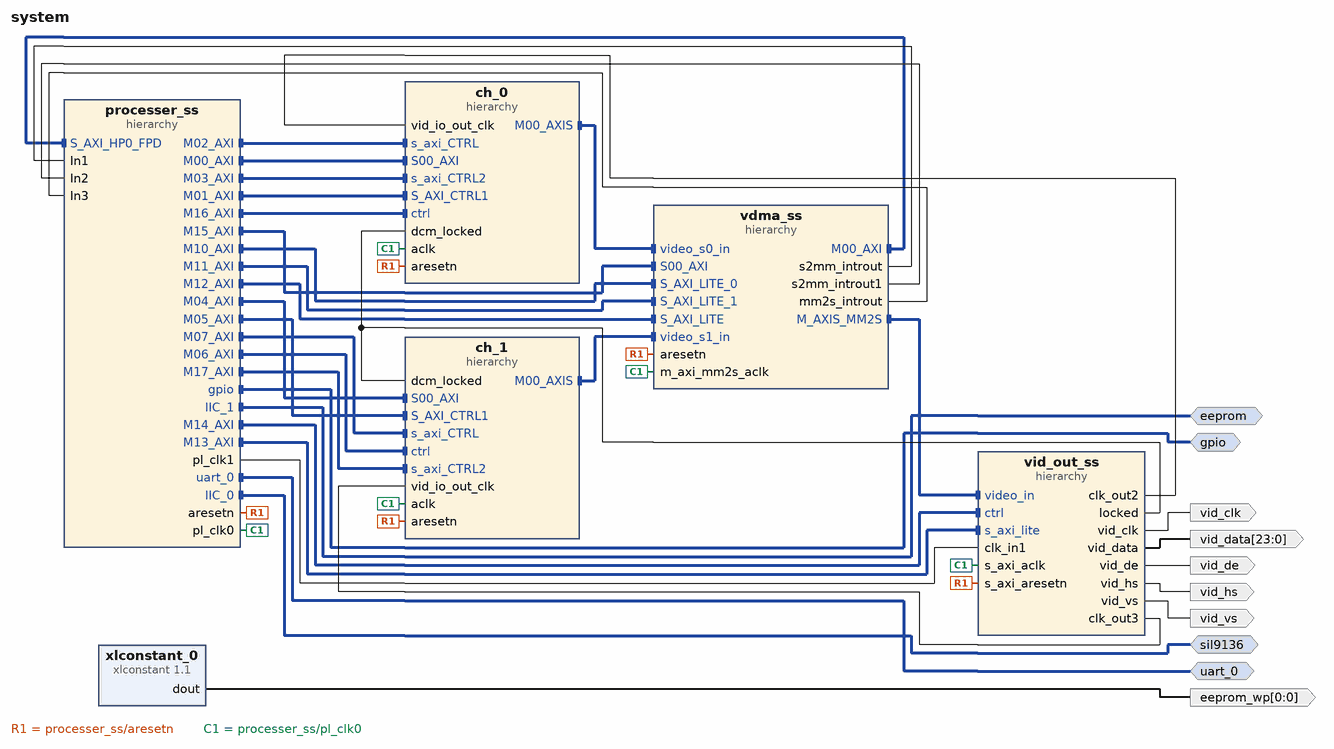
[diagram p0: block diagram of the top level]
# Vivado block design system, xczu2cg-sfvc784-1-e, Vivado 2020.1
create_bd_design system

create_bd_intf_port -mode Master -vlnv xilinx.com:interface:gpio_rtl:1.0 gpio
create_bd_intf_port -mode Master -vlnv xilinx.com:interface:uart_rtl:1.0 uart_0
create_bd_intf_port -mode Master -vlnv xilinx.com:interface:iic_rtl:1.0 sil9136
create_bd_intf_port -mode Master -vlnv xilinx.com:interface:iic_rtl:1.0 eeprom
create_bd_port -dir O vid_clk
create_bd_port -dir O -from 23 -to 0 vid_data
create_bd_port -dir O vid_de
create_bd_port -dir O vid_hs
create_bd_port -dir O vid_vs
create_bd_port -dir O -from 0 -to 0 -type data eeprom_wp

create_bd_cell -type hier ch_0
create_bd_cell -type hier processer_ss
create_bd_cell -type hier vdma_ss
create_bd_cell -type hier vid_out_ss
create_bd_cell -type ip -vlnv xilinx.com:ip:xlconstant:1.1 xlconstant_0
set_property -dict {CONFIG.CONST_VAL 0} [get_bd_cells xlconstant_0]
create_bd_cell -type hier ch_1

# ---- hierarchy /ch_0 ----
current_bd_instance /ch_0
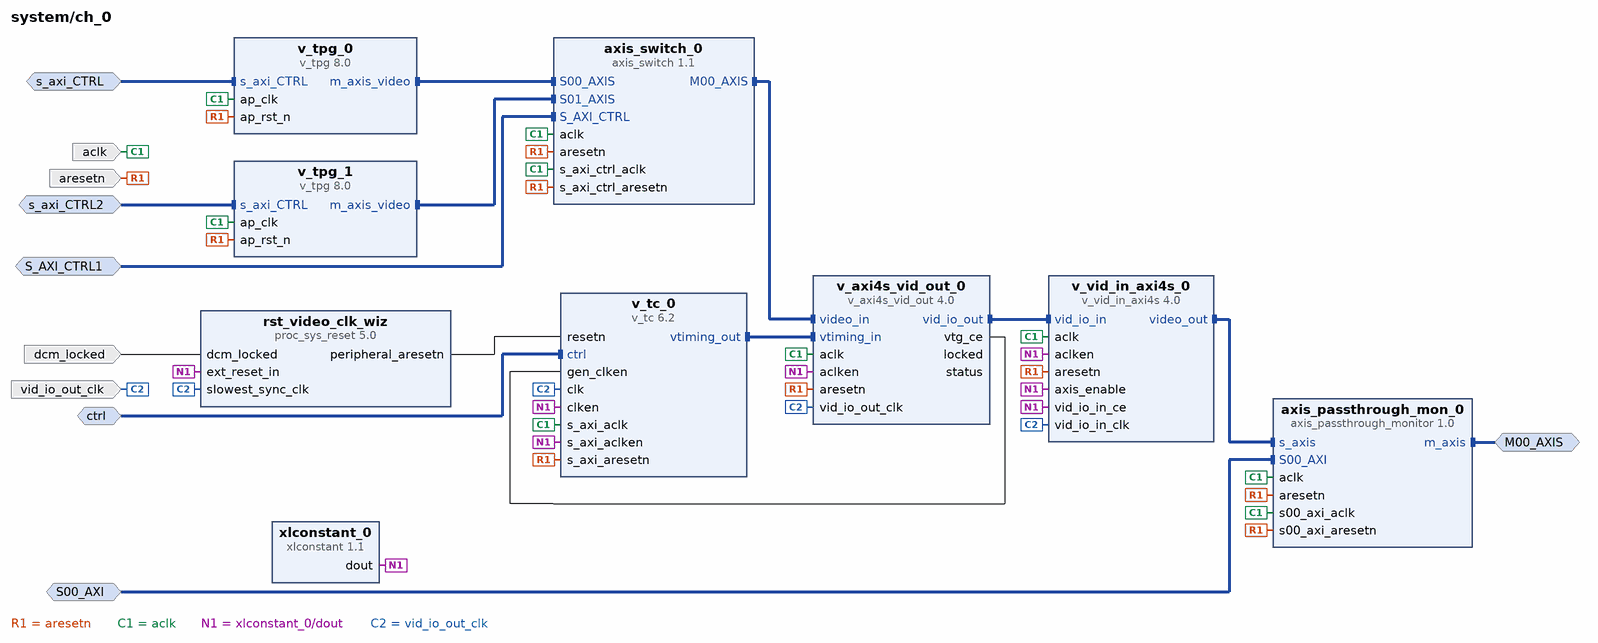
[diagram p1: block diagram inside /ch_0]
create_bd_intf_pin -mode Master -vlnv xilinx.com:interface:axis_rtl:1.0 M00_AXIS
create_bd_intf_pin -mode Slave -vlnv xilinx.com:interface:aximm_rtl:1.0 S00_AXI
create_bd_intf_pin -mode Slave -vlnv xilinx.com:interface:aximm_rtl:1.0 s_axi_CTRL
create_bd_intf_pin -mode Slave -vlnv xilinx.com:interface:aximm_rtl:1.0 S_AXI_CTRL1
create_bd_intf_pin -mode Slave -vlnv xilinx.com:interface:aximm_rtl:1.0 s_axi_CTRL2
create_bd_intf_pin -mode Slave -vlnv xilinx.com:interface:aximm_rtl:1.0 ctrl
create_bd_pin -dir I -type clk aclk
create_bd_pin -dir I -type rst aresetn
create_bd_pin -dir I -type clk vid_io_out_clk
create_bd_pin -dir I dcm_locked

create_bd_cell -type ip -vlnv xilinx.com:user:axis_passthrough_monitor:1.0 axis_passthrough_mon_0
create_bd_cell -type ip -vlnv xilinx.com:ip:v_tpg:8.0 v_tpg_0
set_property -dict {CONFIG.HAS_AXI4_YUV422_YUV420 1 CONFIG.MAX_COLS 3840 CONFIG.MAX_ROWS 2160} [get_bd_cells v_tpg_0]
create_bd_cell -type ip -vlnv xilinx.com:ip:axis_switch:1.1 axis_switch_0
set_property -dict {CONFIG.ROUTING_MODE 1} [get_bd_cells axis_switch_0]
create_bd_cell -type ip -vlnv xilinx.com:ip:v_tpg:8.0 v_tpg_1
set_property -dict {CONFIG.HAS_AXI4_YUV422_YUV420 1 CONFIG.MAX_COLS 3840 CONFIG.MAX_ROWS 2160} [get_bd_cells v_tpg_1]
create_bd_cell -type ip -vlnv xilinx.com:ip:proc_sys_reset:5.0 rst_video_clk_wiz
create_bd_cell -type ip -vlnv xilinx.com:ip:v_axi4s_vid_out:4.0 v_axi4s_vid_out_0
set_property -dict {CONFIG.C_HAS_ASYNC_CLK 1} [get_bd_cells v_axi4s_vid_out_0]
create_bd_cell -type ip -vlnv xilinx.com:ip:v_tc:6.2 v_tc_0
set_property -dict {CONFIG.enable_detection false CONFIG.max_clocks_per_line 8192} [get_bd_cells v_tc_0]
create_bd_cell -type ip -vlnv xilinx.com:ip:xlconstant:1.1 xlconstant_0
create_bd_cell -type ip -vlnv xilinx.com:ip:v_vid_in_axi4s:4.0 v_vid_in_axi4s_0
set_property -dict {CONFIG.C_HAS_ASYNC_CLK 1} [get_bd_cells v_vid_in_axi4s_0]

# ---- hierarchy /processer_ss ----
current_bd_instance /processer_ss
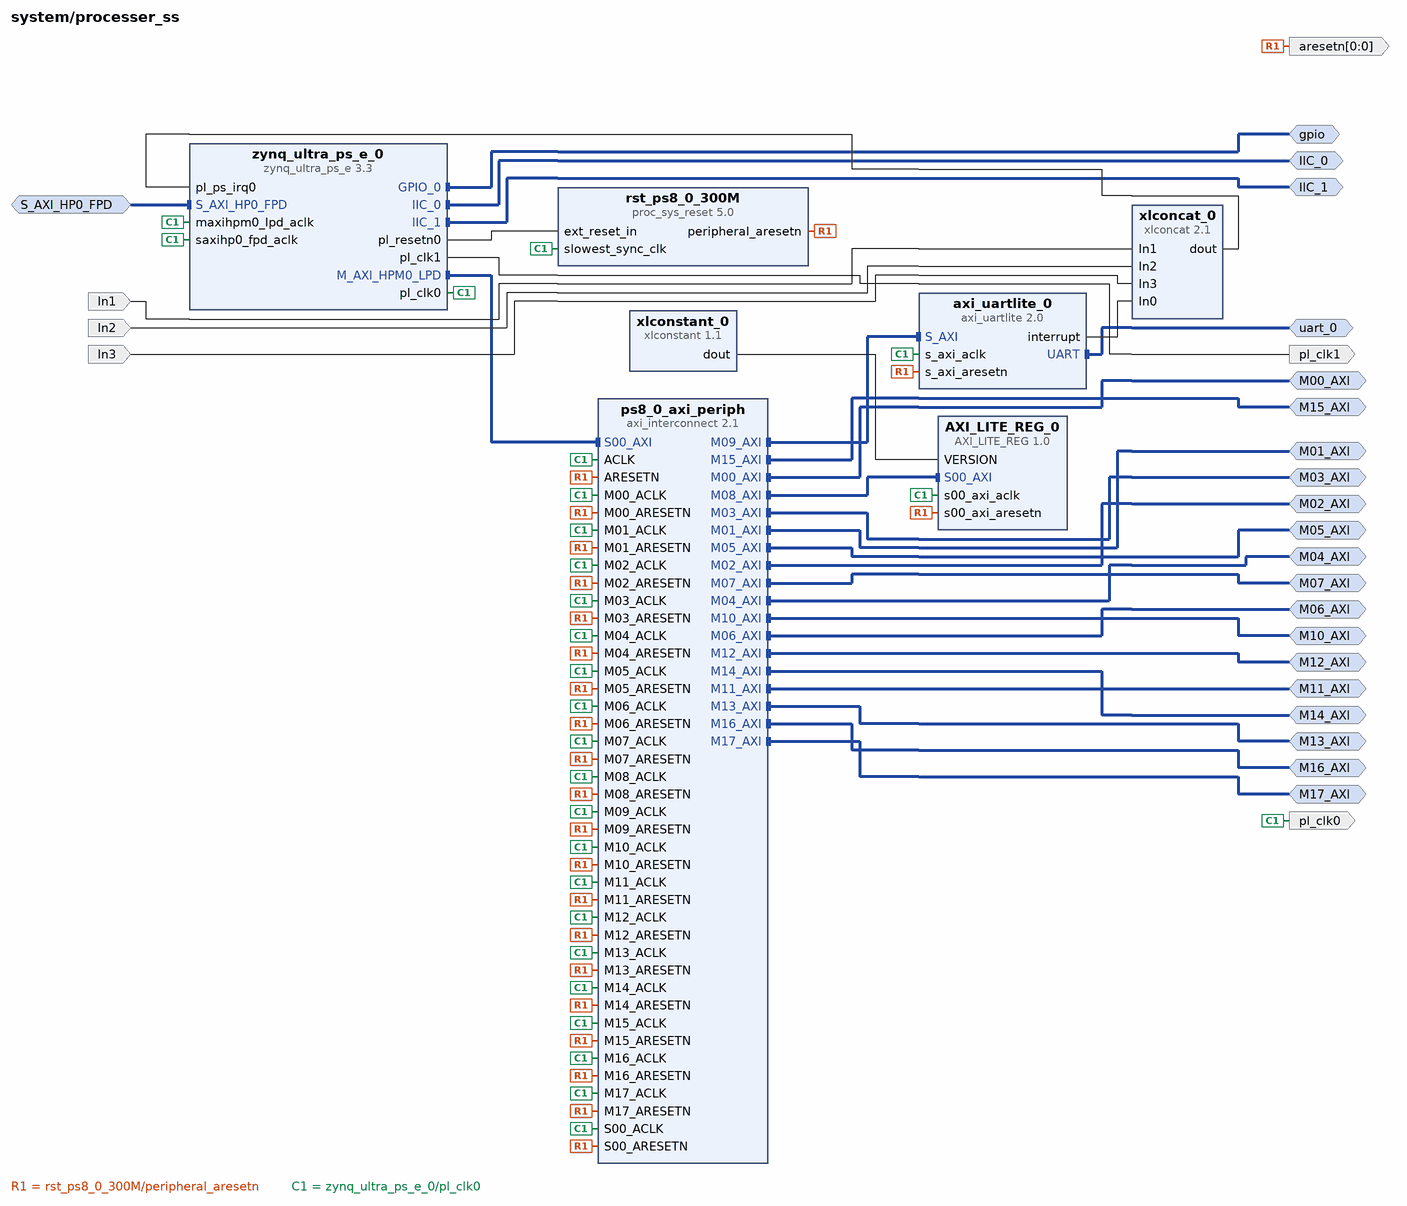
[diagram p2: block diagram inside /processer_ss]
create_bd_intf_pin -mode Slave -vlnv xilinx.com:interface:aximm_rtl:1.0 S_AXI_HP0_FPD
create_bd_intf_pin -mode Master -vlnv xilinx.com:interface:gpio_rtl:1.0 gpio
create_bd_intf_pin -mode Master -vlnv xilinx.com:interface:uart_rtl:1.0 uart_0
create_bd_intf_pin -mode Master -vlnv xilinx.com:interface:aximm_rtl:1.0 M00_AXI
create_bd_intf_pin -mode Master -vlnv xilinx.com:interface:aximm_rtl:1.0 M01_AXI
create_bd_intf_pin -mode Master -vlnv xilinx.com:interface:aximm_rtl:1.0 M02_AXI
create_bd_intf_pin -mode Master -vlnv xilinx.com:interface:aximm_rtl:1.0 M03_AXI
create_bd_intf_pin -mode Master -vlnv xilinx.com:interface:aximm_rtl:1.0 M04_AXI
create_bd_intf_pin -mode Master -vlnv xilinx.com:interface:aximm_rtl:1.0 M05_AXI
create_bd_intf_pin -mode Master -vlnv xilinx.com:interface:aximm_rtl:1.0 M06_AXI
create_bd_intf_pin -mode Master -vlnv xilinx.com:interface:aximm_rtl:1.0 M07_AXI
create_bd_intf_pin -mode Master -vlnv xilinx.com:interface:aximm_rtl:1.0 M10_AXI
create_bd_intf_pin -mode Master -vlnv xilinx.com:interface:aximm_rtl:1.0 M11_AXI
create_bd_intf_pin -mode Master -vlnv xilinx.com:interface:aximm_rtl:1.0 M12_AXI
create_bd_intf_pin -mode Master -vlnv xilinx.com:interface:aximm_rtl:1.0 M13_AXI
create_bd_intf_pin -mode Master -vlnv xilinx.com:interface:aximm_rtl:1.0 M14_AXI
create_bd_intf_pin -mode Master -vlnv xilinx.com:interface:iic_rtl:1.0 IIC_0
create_bd_intf_pin -mode Master -vlnv xilinx.com:interface:iic_rtl:1.0 IIC_1
create_bd_intf_pin -mode Master -vlnv xilinx.com:interface:aximm_rtl:1.0 M15_AXI
create_bd_intf_pin -mode Master -vlnv xilinx.com:interface:aximm_rtl:1.0 M16_AXI
create_bd_intf_pin -mode Master -vlnv xilinx.com:interface:aximm_rtl:1.0 M17_AXI
create_bd_pin -dir O -from 0 -to 0 -type rst aresetn
create_bd_pin -dir O -type clk pl_clk0
create_bd_pin -dir I -type intr In1
create_bd_pin -dir I -type intr In2
create_bd_pin -dir I -type intr In3
create_bd_pin -dir O -type clk pl_clk1

create_bd_cell -type ip -vlnv xilinx.com:user:AXI_LITE_REG:1.0 AXI_LITE_REG_0
create_bd_cell -type ip -vlnv xilinx.com:ip:axi_uartlite:2.0 axi_uartlite_0
create_bd_cell -type ip -vlnv xilinx.com:ip:proc_sys_reset:5.0 rst_ps8_0_300M
create_bd_cell -type ip -vlnv xilinx.com:ip:xlconcat:2.1 xlconcat_0
set_property -dict {CONFIG.NUM_PORTS 4} [get_bd_cells xlconcat_0]
create_bd_cell -type ip -vlnv xilinx.com:ip:xlconstant:1.1 xlconstant_0
set_property -dict {CONFIG.CONST_VAL 0x0b040002 CONFIG.CONST_WIDTH 32} [get_bd_cells xlconstant_0]
create_bd_cell -type ip -vlnv xilinx.com:ip:zynq_ultra_ps_e:3.3 zynq_ultra_ps_e_0
set_property -dict [list \
  CONFIG.PSU_BANK_0_IO_STANDARD LVCMOS18 \
  CONFIG.PSU_BANK_1_IO_STANDARD LVCMOS18 \
  CONFIG.PSU_BANK_2_IO_STANDARD LVCMOS18 \
  CONFIG.PSU__CRF_APB__DDR_CTRL__FREQMHZ 1200 \
  CONFIG.PSU__CRF_APB__DDR_CTRL__SRCSEL DPLL \
  CONFIG.PSU__CRL_APB__PL0_REF_CTRL__FREQMHZ 300 \
  CONFIG.PSU__CRL_APB__PL0_REF_CTRL__SRCSEL RPLL \
  CONFIG.PSU__CRL_APB__PL1_REF_CTRL__FREQMHZ 200 \
  CONFIG.PSU__DDRC__BUS_WIDTH {64 Bit} \
  CONFIG.PSU__DDRC__COMPONENTS Components \
  CONFIG.PSU__DDRC__DEVICE_CAPACITY {4096 MBits} \
  CONFIG.PSU__DDRC__DRAM_WIDTH {16 Bits} \
  CONFIG.PSU__DDRC__ECC Disabled \
  CONFIG.PSU__DDRC__MEMORY_TYPE {DDR 4} \
  CONFIG.PSU__DDRC__SPEED_BIN DDR4_2400P \
  CONFIG.PSU__DDR_HIGH_ADDRESS_GUI_ENABLE 0 \
  CONFIG.PSU__DDR__INTERFACE__FREQMHZ 600.000 \
  CONFIG.PSU__ENET3__FIFO__ENABLE 0 \
  CONFIG.PSU__ENET3__GRP_MDIO__ENABLE 1 \
  CONFIG.PSU__ENET3__GRP_MDIO__IO {MIO 76 .. 77} \
  CONFIG.PSU__ENET3__PERIPHERAL__ENABLE 1 \
  CONFIG.PSU__ENET3__PERIPHERAL__IO {MIO 64 .. 75} \
  CONFIG.PSU__ENET3__PTP__ENABLE 0 \
  CONFIG.PSU__ENET3__TSU__ENABLE 0 \
  CONFIG.PSU__FPGA_PL1_ENABLE 1 \
  CONFIG.PSU__GEM3_COHERENCY 0 \
  CONFIG.PSU__GEM3_ROUTE_THROUGH_FPD 0 \
  CONFIG.PSU__GEM__TSU__ENABLE 0 \
  CONFIG.PSU__GPIO_EMIO_WIDTH 3 \
  CONFIG.PSU__GPIO_EMIO__PERIPHERAL__ENABLE 1 \
  CONFIG.PSU__GPIO_EMIO__PERIPHERAL__IO 3 \
  CONFIG.PSU__I2C0__PERIPHERAL__ENABLE 1 \
  CONFIG.PSU__I2C0__PERIPHERAL__IO EMIO \
  CONFIG.PSU__I2C1__PERIPHERAL__ENABLE 1 \
  CONFIG.PSU__I2C1__PERIPHERAL__IO EMIO \
  CONFIG.PSU__PSS_REF_CLK__FREQMHZ 33.333333 \
  CONFIG.PSU__QSPI_COHERENCY 0 \
  CONFIG.PSU__QSPI_ROUTE_THROUGH_FPD 0 \
  CONFIG.PSU__QSPI__GRP_FBCLK__ENABLE 1 \
  CONFIG.PSU__QSPI__GRP_FBCLK__IO {MIO 6} \
  CONFIG.PSU__QSPI__PERIPHERAL__DATA_MODE x4 \
  CONFIG.PSU__QSPI__PERIPHERAL__ENABLE 1 \
  CONFIG.PSU__QSPI__PERIPHERAL__IO {MIO 0 .. 5} \
  CONFIG.PSU__QSPI__PERIPHERAL__MODE Single \
  CONFIG.PSU__TSU__BUFG_PORT_PAIR 0 \
  CONFIG.PSU__TTC0__CLOCK__ENABLE 0 \
  CONFIG.PSU__TTC0__PERIPHERAL__ENABLE 1 \
  CONFIG.PSU__TTC0__WAVEOUT__ENABLE 0 \
  CONFIG.PSU__TTC1__CLOCK__ENABLE 0 \
  CONFIG.PSU__TTC1__PERIPHERAL__ENABLE 1 \
  CONFIG.PSU__TTC1__WAVEOUT__ENABLE 0 \
  CONFIG.PSU__TTC2__CLOCK__ENABLE 0 \
  CONFIG.PSU__TTC2__PERIPHERAL__ENABLE 1 \
  CONFIG.PSU__TTC2__WAVEOUT__ENABLE 0 \
  CONFIG.PSU__TTC3__CLOCK__ENABLE 0 \
  CONFIG.PSU__TTC3__PERIPHERAL__ENABLE 1 \
  CONFIG.PSU__TTC3__WAVEOUT__ENABLE 0 \
  CONFIG.PSU__UART0__BAUD_RATE 115200 \
  CONFIG.PSU__UART0__MODEM__ENABLE 0 \
  CONFIG.PSU__UART0__PERIPHERAL__ENABLE 1 \
  CONFIG.PSU__UART0__PERIPHERAL__IO {MIO 42 .. 43} \
  CONFIG.PSU__UART1__PERIPHERAL__ENABLE 0 \
  CONFIG.PSU__USE__IRQ0 1 \
  CONFIG.PSU__USE__S_AXI_GP2 1 \
  CONFIG.SUBPRESET1 DDR4_MICRON_MT40A256M16GE_083E \
] [get_bd_cells zynq_ultra_ps_e_0]
# 78 more settings of zynq_ultra_ps_e_0 are not shown: defaults, MIO pin electricals, DDR timing, and values the tool derives
create_bd_cell -type ip -vlnv xilinx.com:ip:axi_interconnect:2.1 ps8_0_axi_periph
set_property -dict {CONFIG.NUM_MI 18} [get_bd_cells ps8_0_axi_periph]

# ---- hierarchy /vdma_ss ----
current_bd_instance /vdma_ss
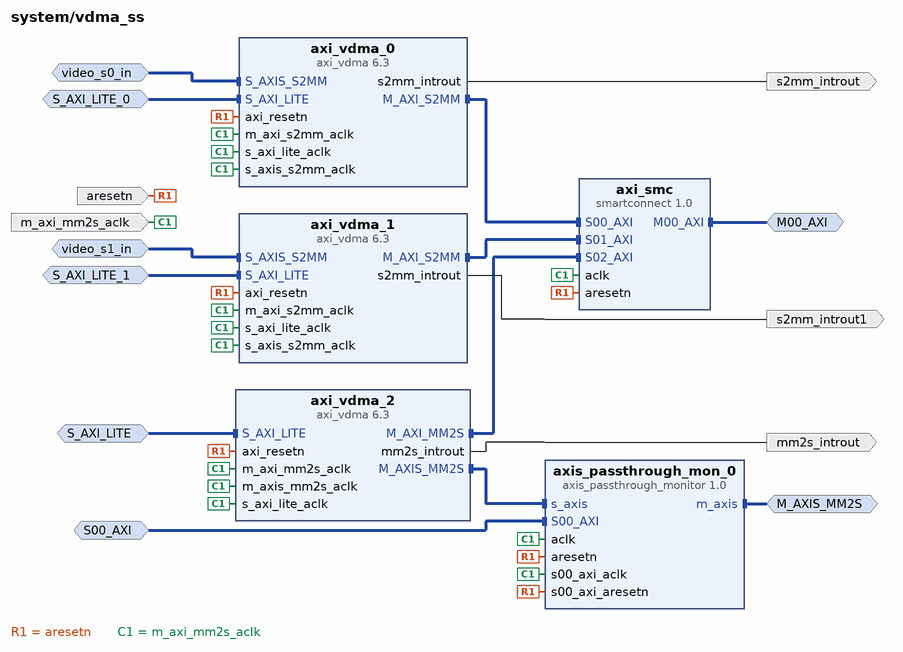
[diagram p3: block diagram inside /vdma_ss]
create_bd_intf_pin -mode Slave -vlnv xilinx.com:interface:aximm_rtl:1.0 S_AXI_LITE_0
create_bd_intf_pin -mode Slave -vlnv xilinx.com:interface:aximm_rtl:1.0 S_AXI_LITE_1
create_bd_intf_pin -mode Slave -vlnv xilinx.com:interface:axis_rtl:1.0 video_s0_in
create_bd_intf_pin -mode Slave -vlnv xilinx.com:interface:axis_rtl:1.0 video_s1_in
create_bd_intf_pin -mode Master -vlnv xilinx.com:interface:aximm_rtl:1.0 M00_AXI
create_bd_intf_pin -mode Slave -vlnv xilinx.com:interface:aximm_rtl:1.0 S_AXI_LITE
create_bd_intf_pin -mode Master -vlnv xilinx.com:interface:axis_rtl:1.0 M_AXIS_MM2S
create_bd_intf_pin -mode Slave -vlnv xilinx.com:interface:aximm_rtl:1.0 S00_AXI
create_bd_pin -dir I -type rst aresetn
create_bd_pin -dir I -type clk m_axi_mm2s_aclk
create_bd_pin -dir O -type intr s2mm_introut
create_bd_pin -dir O -type intr s2mm_introut1
create_bd_pin -dir O -type intr mm2s_introut

create_bd_cell -type ip -vlnv xilinx.com:ip:axi_vdma:6.3 axi_vdma_0
set_property -dict [list \
  CONFIG.c_include_mm2s 0 \
  CONFIG.c_include_s2mm_dre 1 \
  CONFIG.c_m_axi_s2mm_data_width 128 \
  CONFIG.c_num_fstores 3 \
  CONFIG.c_s2mm_linebuffer_depth 2048 \
  CONFIG.c_s2mm_max_burst_length 128 \
] [get_bd_cells axi_vdma_0]
create_bd_cell -type ip -vlnv xilinx.com:ip:axi_vdma:6.3 axi_vdma_1
set_property -dict [list \
  CONFIG.c_include_mm2s 0 \
  CONFIG.c_include_s2mm_dre 1 \
  CONFIG.c_m_axi_s2mm_data_width 128 \
  CONFIG.c_num_fstores 3 \
  CONFIG.c_s2mm_linebuffer_depth 2048 \
  CONFIG.c_s2mm_max_burst_length 128 \
] [get_bd_cells axi_vdma_1]
create_bd_cell -type ip -vlnv xilinx.com:ip:axi_vdma:6.3 axi_vdma_2
set_property -dict [list \
  CONFIG.c_include_mm2s 1 \
  CONFIG.c_include_mm2s_dre 1 \
  CONFIG.c_include_s2mm 0 \
  CONFIG.c_m_axi_mm2s_data_width 128 \
  CONFIG.c_m_axis_mm2s_tdata_width 24 \
  CONFIG.c_mm2s_genlock_mode 3 \
  CONFIG.c_mm2s_linebuffer_depth 2048 \
  CONFIG.c_mm2s_max_burst_length 128 \
  CONFIG.c_num_fstores 3 \
] [get_bd_cells axi_vdma_2]
create_bd_cell -type ip -vlnv xilinx.com:ip:smartconnect:1.0 axi_smc
set_property -dict {CONFIG.NUM_SI 3} [get_bd_cells axi_smc]
create_bd_cell -type ip -vlnv xilinx.com:user:axis_passthrough_monitor:1.0 axis_passthrough_mon_0

# ---- hierarchy /vid_out_ss ----
current_bd_instance /vid_out_ss
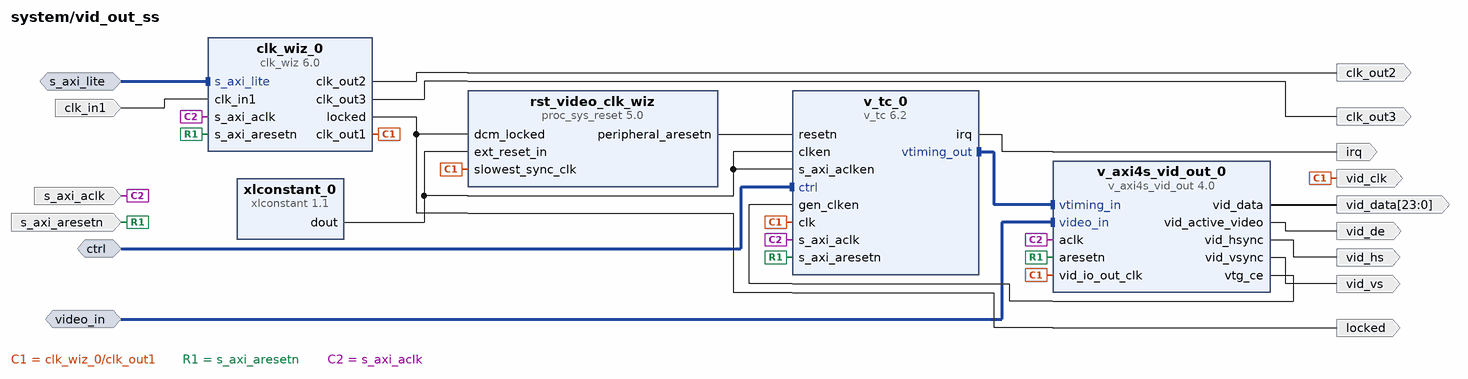
[diagram p4: block diagram inside /vid_out_ss]
create_bd_intf_pin -mode Slave -vlnv xilinx.com:interface:aximm_rtl:1.0 ctrl
create_bd_intf_pin -mode Slave -vlnv xilinx.com:interface:aximm_rtl:1.0 s_axi_lite
create_bd_intf_pin -mode Slave -vlnv xilinx.com:interface:axis_rtl:1.0 video_in
create_bd_pin -dir I -type clk clk_in1
create_bd_pin -dir O -type intr irq
create_bd_pin -dir I -type clk s_axi_aclk
create_bd_pin -dir I -type rst s_axi_aresetn
create_bd_pin -dir O -type clk vid_clk
create_bd_pin -dir O -from 23 -to 0 vid_data
create_bd_pin -dir O vid_de
create_bd_pin -dir O vid_hs
create_bd_pin -dir O vid_vs
create_bd_pin -dir O -type clk clk_out2
create_bd_pin -dir O -type clk clk_out3
create_bd_pin -dir O locked

create_bd_cell -type ip -vlnv xilinx.com:ip:clk_wiz:6.0 clk_wiz_0
set_property -dict [list \
  CONFIG.CLKIN1_JITTER_PS 50.0 \
  CONFIG.CLKOUT1_JITTER 196.193 \
  CONFIG.CLKOUT1_PHASE_ERROR 350.217 \
  CONFIG.CLKOUT1_REQUESTED_OUT_FREQ 148.5 \
  CONFIG.CLKOUT2_JITTER 246.475 \
  CONFIG.CLKOUT2_PHASE_ERROR 350.217 \
  CONFIG.CLKOUT2_REQUESTED_OUT_FREQ 30.15 \
  CONFIG.CLKOUT2_USED true \
  CONFIG.CLKOUT3_DRIVES Buffer \
  CONFIG.CLKOUT3_JITTER 246.475 \
  CONFIG.CLKOUT3_PHASE_ERROR 350.217 \
  CONFIG.CLKOUT3_REQUESTED_OUT_FREQ 30.15 \
  CONFIG.CLKOUT3_USED true \
  CONFIG.CLKOUT4_JITTER 96.286 \
  CONFIG.CLKOUT4_PHASE_ERROR 138.946 \
  CONFIG.CLKOUT4_REQUESTED_OUT_FREQ 100.000 \
  CONFIG.CLKOUT4_USED false \
  CONFIG.MMCM_CLKFBOUT_MULT_F 114.625 \
  CONFIG.MMCM_CLKIN1_PERIOD 5.000 \
  CONFIG.MMCM_CLKIN2_PERIOD 10.0 \
  CONFIG.MMCM_CLKOUT0_DIVIDE_F 8.125 \
  CONFIG.MMCM_CLKOUT1_DIVIDE 40 \
  CONFIG.MMCM_CLKOUT2_DIVIDE 40 \
  CONFIG.MMCM_CLKOUT3_DIVIDE 1 \
  CONFIG.MMCM_DIVCLK_DIVIDE 19 \
  CONFIG.NUM_OUT_CLKS 3 \
  CONFIG.OVERRIDE_MMCM false \
  CONFIG.PRIM_IN_FREQ 200.000 \
  CONFIG.USE_DYN_RECONFIG true \
] [get_bd_cells clk_wiz_0]
create_bd_cell -type ip -vlnv xilinx.com:ip:proc_sys_reset:5.0 rst_video_clk_wiz
create_bd_cell -type ip -vlnv xilinx.com:ip:v_axi4s_vid_out:4.0 v_axi4s_vid_out_0
set_property -dict {CONFIG.C_HAS_ASYNC_CLK 1} [get_bd_cells v_axi4s_vid_out_0]
create_bd_cell -type ip -vlnv xilinx.com:ip:v_tc:6.2 v_tc_0
set_property -dict {CONFIG.enable_detection false CONFIG.max_clocks_per_line 8192} [get_bd_cells v_tc_0]
create_bd_cell -type ip -vlnv xilinx.com:ip:xlconstant:1.1 xlconstant_0

# ---- hierarchy /ch_1 ----
current_bd_instance /ch_1
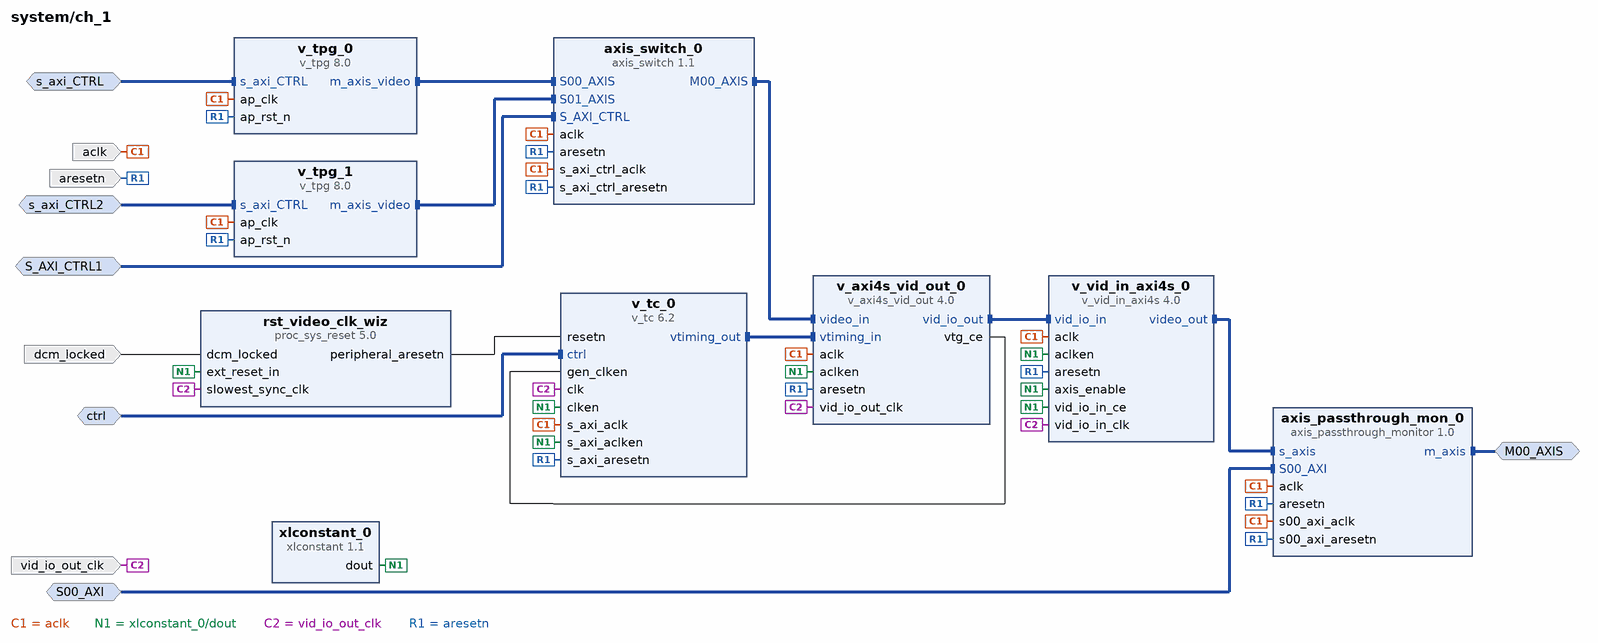
[diagram p5: block diagram inside /ch_1]
create_bd_intf_pin -mode Master -vlnv xilinx.com:interface:axis_rtl:1.0 M00_AXIS
create_bd_intf_pin -mode Slave -vlnv xilinx.com:interface:aximm_rtl:1.0 S00_AXI
create_bd_intf_pin -mode Slave -vlnv xilinx.com:interface:aximm_rtl:1.0 s_axi_CTRL
create_bd_intf_pin -mode Slave -vlnv xilinx.com:interface:aximm_rtl:1.0 S_AXI_CTRL1
create_bd_intf_pin -mode Slave -vlnv xilinx.com:interface:aximm_rtl:1.0 s_axi_CTRL2
create_bd_intf_pin -mode Slave -vlnv xilinx.com:interface:aximm_rtl:1.0 ctrl
create_bd_pin -dir I -type clk aclk
create_bd_pin -dir I -type rst aresetn
create_bd_pin -dir I -type clk vid_io_out_clk
create_bd_pin -dir I dcm_locked

create_bd_cell -type ip -vlnv xilinx.com:user:axis_passthrough_monitor:1.0 axis_passthrough_mon_0
create_bd_cell -type ip -vlnv xilinx.com:ip:v_tpg:8.0 v_tpg_0
set_property -dict {CONFIG.HAS_AXI4_YUV422_YUV420 1 CONFIG.MAX_COLS 3840 CONFIG.MAX_ROWS 2160} [get_bd_cells v_tpg_0]
create_bd_cell -type ip -vlnv xilinx.com:ip:axis_switch:1.1 axis_switch_0
set_property -dict {CONFIG.ROUTING_MODE 1} [get_bd_cells axis_switch_0]
create_bd_cell -type ip -vlnv xilinx.com:ip:v_tpg:8.0 v_tpg_1
set_property -dict {CONFIG.HAS_AXI4_YUV422_YUV420 1 CONFIG.MAX_COLS 3840 CONFIG.MAX_ROWS 2160} [get_bd_cells v_tpg_1]
create_bd_cell -type ip -vlnv xilinx.com:ip:proc_sys_reset:5.0 rst_video_clk_wiz
create_bd_cell -type ip -vlnv xilinx.com:ip:v_axi4s_vid_out:4.0 v_axi4s_vid_out_0
set_property -dict {CONFIG.C_HAS_ASYNC_CLK 1} [get_bd_cells v_axi4s_vid_out_0]
create_bd_cell -type ip -vlnv xilinx.com:ip:v_tc:6.2 v_tc_0
set_property -dict {CONFIG.enable_detection false CONFIG.max_clocks_per_line 8192} [get_bd_cells v_tc_0]
create_bd_cell -type ip -vlnv xilinx.com:ip:xlconstant:1.1 xlconstant_0
create_bd_cell -type ip -vlnv xilinx.com:ip:v_vid_in_axi4s:4.0 v_vid_in_axi4s_0
set_property -dict {CONFIG.C_HAS_ASYNC_CLK 1} [get_bd_cells v_vid_in_axi4s_0]

# ---- connections ----

current_bd_instance /ch_0
connect_bd_intf_net [get_bd_intf_pins v_axi4s_vid_out_0/vid_io_out] [get_bd_intf_pins v_vid_in_axi4s_0/vid_io_in]
connect_bd_intf_net [get_bd_intf_pins s_axi_CTRL2] [get_bd_intf_pins v_tpg_1/s_axi_CTRL]
connect_bd_intf_net [get_bd_intf_pins s_axi_CTRL] [get_bd_intf_pins v_tpg_0/s_axi_CTRL]
connect_bd_intf_net [get_bd_intf_pins S00_AXI] [get_bd_intf_pins axis_passthrough_mon_0/S00_AXI]
connect_bd_intf_net [get_bd_intf_pins axis_switch_0/M00_AXIS] [get_bd_intf_pins v_axi4s_vid_out_0/video_in]
connect_bd_intf_net [get_bd_intf_pins M00_AXIS] [get_bd_intf_pins axis_passthrough_mon_0/m_axis]
connect_bd_intf_net [get_bd_intf_pins v_tpg_0/m_axis_video] [get_bd_intf_pins axis_switch_0/S00_AXIS]
connect_bd_intf_net [get_bd_intf_pins v_tpg_1/m_axis_video] [get_bd_intf_pins axis_switch_0/S01_AXIS]
connect_bd_intf_net [get_bd_intf_pins S_AXI_CTRL1] [get_bd_intf_pins axis_switch_0/S_AXI_CTRL]
connect_bd_intf_net [get_bd_intf_pins v_vid_in_axi4s_0/video_out] [get_bd_intf_pins axis_passthrough_mon_0/s_axis]
connect_bd_intf_net [get_bd_intf_pins v_tc_0/vtiming_out] [get_bd_intf_pins v_axi4s_vid_out_0/vtiming_in]
connect_bd_intf_net [get_bd_intf_pins ctrl] [get_bd_intf_pins v_tc_0/ctrl]
connect_bd_net -net rst_ps8_0_300M_peripheral_aresetn [get_bd_pins aresetn] \
  [get_bd_pins axis_passthrough_mon_0/aresetn] [get_bd_pins axis_passthrough_mon_0/s00_axi_aresetn] \
  [get_bd_pins v_tpg_0/ap_rst_n] [get_bd_pins axis_switch_0/aresetn] [get_bd_pins v_tpg_1/ap_rst_n] \
  [get_bd_pins axis_switch_0/s_axi_ctrl_aresetn] [get_bd_pins v_tc_0/s_axi_aresetn] [get_bd_pins v_axi4s_vid_out_0/aresetn] \
  [get_bd_pins v_vid_in_axi4s_0/aresetn]
connect_bd_net -net zynq_ultra_ps_e_0_pl_clk0 [get_bd_pins aclk] \
  [get_bd_pins axis_passthrough_mon_0/aclk] [get_bd_pins axis_passthrough_mon_0/s00_axi_aclk] [get_bd_pins v_tpg_0/ap_clk] \
  [get_bd_pins axis_switch_0/aclk] [get_bd_pins v_tpg_1/ap_clk] [get_bd_pins axis_switch_0/s_axi_ctrl_aclk] \
  [get_bd_pins v_tc_0/s_axi_aclk] [get_bd_pins v_vid_in_axi4s_0/aclk] [get_bd_pins v_axi4s_vid_out_0/aclk]
connect_bd_net [get_bd_pins rst_video_clk_wiz/peripheral_aresetn] [get_bd_pins v_tc_0/resetn]
connect_bd_net [get_bd_pins xlconstant_0/dout] \
  [get_bd_pins v_tc_0/clken] [get_bd_pins v_tc_0/s_axi_aclken] [get_bd_pins rst_video_clk_wiz/ext_reset_in] \
  [get_bd_pins v_axi4s_vid_out_0/aclken] [get_bd_pins v_vid_in_axi4s_0/aclken] [get_bd_pins v_vid_in_axi4s_0/vid_io_in_ce] \
  [get_bd_pins v_vid_in_axi4s_0/axis_enable]
connect_bd_net [get_bd_pins vid_io_out_clk] \
  [get_bd_pins v_tc_0/clk] [get_bd_pins v_axi4s_vid_out_0/vid_io_out_clk] [get_bd_pins rst_video_clk_wiz/slowest_sync_clk] \
  [get_bd_pins v_vid_in_axi4s_0/vid_io_in_clk]
connect_bd_net [get_bd_pins v_axi4s_vid_out_0/vtg_ce] [get_bd_pins v_tc_0/gen_clken]
connect_bd_net [get_bd_pins dcm_locked] [get_bd_pins rst_video_clk_wiz/dcm_locked]
# net status has one end: v_axi4s_vid_out_0/status
# net locked has one end: v_axi4s_vid_out_0/locked

current_bd_instance /processer_ss
connect_bd_intf_net [get_bd_intf_pins M15_AXI] [get_bd_intf_pins ps8_0_axi_periph/M15_AXI]
connect_bd_intf_net [get_bd_intf_pins gpio] [get_bd_intf_pins zynq_ultra_ps_e_0/GPIO_0]
connect_bd_intf_net [get_bd_intf_pins S_AXI_HP0_FPD] [get_bd_intf_pins zynq_ultra_ps_e_0/S_AXI_HP0_FPD]
connect_bd_intf_net [get_bd_intf_pins uart_0] [get_bd_intf_pins axi_uartlite_0/UART]
connect_bd_intf_net [get_bd_intf_pins M00_AXI] [get_bd_intf_pins ps8_0_axi_periph/M00_AXI]
connect_bd_intf_net [get_bd_intf_pins M03_AXI] [get_bd_intf_pins ps8_0_axi_periph/M03_AXI]
connect_bd_intf_net [get_bd_intf_pins zynq_ultra_ps_e_0/M_AXI_HPM0_LPD] [get_bd_intf_pins ps8_0_axi_periph/S00_AXI]
connect_bd_intf_net [get_bd_intf_pins M05_AXI] [get_bd_intf_pins ps8_0_axi_periph/M05_AXI]
connect_bd_intf_net [get_bd_intf_pins IIC_0] [get_bd_intf_pins zynq_ultra_ps_e_0/IIC_0]
connect_bd_intf_net [get_bd_intf_pins M07_AXI] [get_bd_intf_pins ps8_0_axi_periph/M07_AXI]
connect_bd_intf_net [get_bd_intf_pins IIC_1] [get_bd_intf_pins zynq_ultra_ps_e_0/IIC_1]
connect_bd_intf_net [get_bd_intf_pins M01_AXI] [get_bd_intf_pins ps8_0_axi_periph/M01_AXI]
connect_bd_intf_net [get_bd_intf_pins M02_AXI] [get_bd_intf_pins ps8_0_axi_periph/M02_AXI]
connect_bd_intf_net [get_bd_intf_pins ps8_0_axi_periph/M09_AXI] [get_bd_intf_pins axi_uartlite_0/S_AXI]
connect_bd_intf_net [get_bd_intf_pins M12_AXI] [get_bd_intf_pins ps8_0_axi_periph/M12_AXI]
connect_bd_intf_net [get_bd_intf_pins M10_AXI] [get_bd_intf_pins ps8_0_axi_periph/M10_AXI]
connect_bd_intf_net [get_bd_intf_pins M14_AXI] [get_bd_intf_pins ps8_0_axi_periph/M14_AXI]
connect_bd_intf_net [get_bd_intf_pins M04_AXI] [get_bd_intf_pins ps8_0_axi_periph/M04_AXI]
connect_bd_intf_net [get_bd_intf_pins M11_AXI] [get_bd_intf_pins ps8_0_axi_periph/M11_AXI]
connect_bd_intf_net [get_bd_intf_pins M06_AXI] [get_bd_intf_pins ps8_0_axi_periph/M06_AXI]
connect_bd_intf_net [get_bd_intf_pins M13_AXI] [get_bd_intf_pins ps8_0_axi_periph/M13_AXI]
connect_bd_intf_net [get_bd_intf_pins ps8_0_axi_periph/M08_AXI] [get_bd_intf_pins AXI_LITE_REG_0/S00_AXI]
connect_bd_intf_net [get_bd_intf_pins M16_AXI] [get_bd_intf_pins ps8_0_axi_periph/M16_AXI]
connect_bd_intf_net [get_bd_intf_pins M17_AXI] [get_bd_intf_pins ps8_0_axi_periph/M17_AXI]
connect_bd_net [get_bd_pins axi_uartlite_0/interrupt] [get_bd_pins xlconcat_0/In0]
connect_bd_net [get_bd_pins rst_ps8_0_300M/peripheral_aresetn] \
  [get_bd_pins aresetn] [get_bd_pins AXI_LITE_REG_0/s00_axi_aresetn] [get_bd_pins axi_uartlite_0/s_axi_aresetn] \
  [get_bd_pins ps8_0_axi_periph/S00_ARESETN] [get_bd_pins ps8_0_axi_periph/M00_ARESETN] \
  [get_bd_pins ps8_0_axi_periph/ARESETN] [get_bd_pins ps8_0_axi_periph/M01_ARESETN] \
  [get_bd_pins ps8_0_axi_periph/M02_ARESETN] [get_bd_pins ps8_0_axi_periph/M03_ARESETN] \
  [get_bd_pins ps8_0_axi_periph/M04_ARESETN] [get_bd_pins ps8_0_axi_periph/M05_ARESETN] \
  [get_bd_pins ps8_0_axi_periph/M06_ARESETN] [get_bd_pins ps8_0_axi_periph/M07_ARESETN] \
  [get_bd_pins ps8_0_axi_periph/M08_ARESETN] [get_bd_pins ps8_0_axi_periph/M09_ARESETN] \
  [get_bd_pins ps8_0_axi_periph/M10_ARESETN] [get_bd_pins ps8_0_axi_periph/M11_ARESETN] \
  [get_bd_pins ps8_0_axi_periph/M12_ARESETN] [get_bd_pins ps8_0_axi_periph/M13_ARESETN] \
  [get_bd_pins ps8_0_axi_periph/M14_ARESETN] [get_bd_pins ps8_0_axi_periph/M15_ARESETN] \
  [get_bd_pins ps8_0_axi_periph/M16_ARESETN] [get_bd_pins ps8_0_axi_periph/M17_ARESETN]
connect_bd_net [get_bd_pins xlconcat_0/dout] [get_bd_pins zynq_ultra_ps_e_0/pl_ps_irq0]
connect_bd_net [get_bd_pins xlconstant_0/dout] [get_bd_pins AXI_LITE_REG_0/VERSION]
connect_bd_net [get_bd_pins zynq_ultra_ps_e_0/pl_clk0] \
  [get_bd_pins pl_clk0] [get_bd_pins AXI_LITE_REG_0/s00_axi_aclk] [get_bd_pins axi_uartlite_0/s_axi_aclk] \
  [get_bd_pins rst_ps8_0_300M/slowest_sync_clk] [get_bd_pins zynq_ultra_ps_e_0/maxihpm0_lpd_aclk] \
  [get_bd_pins zynq_ultra_ps_e_0/saxihp0_fpd_aclk] [get_bd_pins ps8_0_axi_periph/ACLK] \
  [get_bd_pins ps8_0_axi_periph/S00_ACLK] [get_bd_pins ps8_0_axi_periph/M00_ACLK] [get_bd_pins ps8_0_axi_periph/M01_ACLK] \
  [get_bd_pins ps8_0_axi_periph/M02_ACLK] [get_bd_pins ps8_0_axi_periph/M03_ACLK] [get_bd_pins ps8_0_axi_periph/M04_ACLK] \
  [get_bd_pins ps8_0_axi_periph/M05_ACLK] [get_bd_pins ps8_0_axi_periph/M06_ACLK] [get_bd_pins ps8_0_axi_periph/M07_ACLK] \
  [get_bd_pins ps8_0_axi_periph/M08_ACLK] [get_bd_pins ps8_0_axi_periph/M09_ACLK] [get_bd_pins ps8_0_axi_periph/M10_ACLK] \
  [get_bd_pins ps8_0_axi_periph/M11_ACLK] [get_bd_pins ps8_0_axi_periph/M12_ACLK] [get_bd_pins ps8_0_axi_periph/M13_ACLK] \
  [get_bd_pins ps8_0_axi_periph/M14_ACLK] [get_bd_pins ps8_0_axi_periph/M15_ACLK] [get_bd_pins ps8_0_axi_periph/M16_ACLK] \
  [get_bd_pins ps8_0_axi_periph/M17_ACLK]
connect_bd_net [get_bd_pins zynq_ultra_ps_e_0/pl_resetn0] [get_bd_pins rst_ps8_0_300M/ext_reset_in]
connect_bd_net -net In1_1 [get_bd_pins In1] [get_bd_pins xlconcat_0/In1]
connect_bd_net -net In2_1 [get_bd_pins In2] [get_bd_pins xlconcat_0/In2]
connect_bd_net -net In3_1 [get_bd_pins In3] [get_bd_pins xlconcat_0/In3]
connect_bd_net [get_bd_pins zynq_ultra_ps_e_0/pl_clk1] [get_bd_pins pl_clk1]

current_bd_instance /vdma_ss
connect_bd_intf_net [get_bd_intf_pins video_s0_in] [get_bd_intf_pins axi_vdma_0/S_AXIS_S2MM]
connect_bd_intf_net [get_bd_intf_pins M_AXIS_MM2S] [get_bd_intf_pins axis_passthrough_mon_0/m_axis]
connect_bd_intf_net [get_bd_intf_pins S_AXI_LITE] [get_bd_intf_pins axi_vdma_2/S_AXI_LITE]
connect_bd_intf_net [get_bd_intf_pins video_s1_in] [get_bd_intf_pins axi_vdma_1/S_AXIS_S2MM]
connect_bd_intf_net [get_bd_intf_pins S_AXI_LITE_0] [get_bd_intf_pins axi_vdma_0/S_AXI_LITE]
connect_bd_intf_net [get_bd_intf_pins S_AXI_LITE_1] [get_bd_intf_pins axi_vdma_1/S_AXI_LITE]
connect_bd_intf_net [get_bd_intf_pins S00_AXI] [get_bd_intf_pins axis_passthrough_mon_0/S00_AXI]
connect_bd_intf_net [get_bd_intf_pins axi_vdma_2/M_AXI_MM2S] [get_bd_intf_pins axi_smc/S02_AXI]
connect_bd_intf_net [get_bd_intf_pins axi_vdma_0/M_AXI_S2MM] [get_bd_intf_pins axi_smc/S00_AXI]
connect_bd_intf_net [get_bd_intf_pins M00_AXI] [get_bd_intf_pins axi_smc/M00_AXI]
connect_bd_intf_net [get_bd_intf_pins axi_vdma_1/M_AXI_S2MM] [get_bd_intf_pins axi_smc/S01_AXI]
connect_bd_intf_net [get_bd_intf_pins axis_passthrough_mon_0/s_axis] [get_bd_intf_pins axi_vdma_2/M_AXIS_MM2S]
connect_bd_net -net rst_ps8_0_300M_peripheral_aresetn [get_bd_pins aresetn] \
  [get_bd_pins axi_vdma_0/axi_resetn] [get_bd_pins axi_vdma_1/axi_resetn] [get_bd_pins axi_smc/aresetn] \
  [get_bd_pins axi_vdma_2/axi_resetn] [get_bd_pins axis_passthrough_mon_0/aresetn] \
  [get_bd_pins axis_passthrough_mon_0/s00_axi_aresetn]
connect_bd_net -net zynq_ultra_ps_e_0_pl_clk0 [get_bd_pins m_axi_mm2s_aclk] \
  [get_bd_pins axi_vdma_0/m_axi_s2mm_aclk] [get_bd_pins axi_vdma_0/s_axi_lite_aclk] [get_bd_pins axi_vdma_0/s_axis_s2mm_aclk] \
  [get_bd_pins axi_vdma_1/m_axi_s2mm_aclk] [get_bd_pins axi_vdma_1/s_axi_lite_aclk] [get_bd_pins axi_vdma_1/s_axis_s2mm_aclk] \
  [get_bd_pins axi_smc/aclk] [get_bd_pins axi_vdma_2/s_axi_lite_aclk] [get_bd_pins axi_vdma_2/m_axi_mm2s_aclk] \
  [get_bd_pins axi_vdma_2/m_axis_mm2s_aclk] [get_bd_pins axis_passthrough_mon_0/aclk] \
  [get_bd_pins axis_passthrough_mon_0/s00_axi_aclk]
connect_bd_net [get_bd_pins axi_vdma_0/s2mm_introut] [get_bd_pins s2mm_introut]
connect_bd_net [get_bd_pins axi_vdma_1/s2mm_introut] [get_bd_pins s2mm_introut1]
connect_bd_net -net axi_vdma_3_mm2s_introut [get_bd_pins axi_vdma_2/mm2s_introut] [get_bd_pins mm2s_introut]

current_bd_instance /vid_out_ss
connect_bd_intf_net [get_bd_intf_pins ctrl] [get_bd_intf_pins v_tc_0/ctrl]
connect_bd_intf_net [get_bd_intf_pins s_axi_lite] [get_bd_intf_pins clk_wiz_0/s_axi_lite]
connect_bd_intf_net [get_bd_intf_pins v_axi4s_vid_out_0/vtiming_in] [get_bd_intf_pins v_tc_0/vtiming_out]
connect_bd_intf_net [get_bd_intf_pins video_in] [get_bd_intf_pins v_axi4s_vid_out_0/video_in]
connect_bd_net [get_bd_pins clk_wiz_0/clk_out1] \
  [get_bd_pins vid_clk] [get_bd_pins rst_video_clk_wiz/slowest_sync_clk] [get_bd_pins v_axi4s_vid_out_0/vid_io_out_clk] \
  [get_bd_pins v_tc_0/clk]
connect_bd_net [get_bd_pins clk_wiz_0/locked] [get_bd_pins rst_video_clk_wiz/dcm_locked] [get_bd_pins locked]
connect_bd_net -net rst_ps8_0_300M_peripheral_aresetn [get_bd_pins s_axi_aresetn] \
  [get_bd_pins clk_wiz_0/s_axi_aresetn] [get_bd_pins v_axi4s_vid_out_0/aresetn] [get_bd_pins v_tc_0/s_axi_aresetn]
connect_bd_net [get_bd_pins rst_video_clk_wiz/peripheral_aresetn] [get_bd_pins v_tc_0/resetn]
connect_bd_net [get_bd_pins v_axi4s_vid_out_0/vid_active_video] [get_bd_pins vid_de]
connect_bd_net [get_bd_pins v_axi4s_vid_out_0/vid_data] [get_bd_pins vid_data]
connect_bd_net [get_bd_pins v_axi4s_vid_out_0/vid_hsync] [get_bd_pins vid_hs]
connect_bd_net [get_bd_pins v_axi4s_vid_out_0/vid_vsync] [get_bd_pins vid_vs]
connect_bd_net [get_bd_pins v_axi4s_vid_out_0/vtg_ce] [get_bd_pins v_tc_0/gen_clken]
connect_bd_net [get_bd_pins v_tc_0/irq] [get_bd_pins irq]
connect_bd_net [get_bd_pins xlconstant_0/dout] \
  [get_bd_pins rst_video_clk_wiz/ext_reset_in] [get_bd_pins v_tc_0/clken] [get_bd_pins v_tc_0/s_axi_aclken]
connect_bd_net -net zynq_ultra_ps_e_0_pl_clk0 [get_bd_pins s_axi_aclk] \
  [get_bd_pins clk_wiz_0/s_axi_aclk] [get_bd_pins v_axi4s_vid_out_0/aclk] [get_bd_pins v_tc_0/s_axi_aclk]
connect_bd_net -net zynq_ultra_ps_e_0_pl_clk1 [get_bd_pins clk_in1] [get_bd_pins clk_wiz_0/clk_in1]
connect_bd_net [get_bd_pins clk_wiz_0/clk_out2] [get_bd_pins clk_out2]
connect_bd_net [get_bd_pins clk_wiz_0/clk_out3] [get_bd_pins clk_out3]

current_bd_instance /ch_1
connect_bd_intf_net [get_bd_intf_pins s_axi_CTRL2] [get_bd_intf_pins v_tpg_1/s_axi_CTRL]
connect_bd_intf_net [get_bd_intf_pins S_AXI_CTRL1] [get_bd_intf_pins axis_switch_0/S_AXI_CTRL]
connect_bd_intf_net [get_bd_intf_pins M00_AXIS] [get_bd_intf_pins axis_passthrough_mon_0/m_axis]
connect_bd_intf_net [get_bd_intf_pins v_tpg_0/m_axis_video] [get_bd_intf_pins axis_switch_0/S00_AXIS]
connect_bd_intf_net [get_bd_intf_pins s_axi_CTRL] [get_bd_intf_pins v_tpg_0/s_axi_CTRL]
connect_bd_intf_net [get_bd_intf_pins v_tpg_1/m_axis_video] [get_bd_intf_pins axis_switch_0/S01_AXIS]
connect_bd_intf_net [get_bd_intf_pins S00_AXI] [get_bd_intf_pins axis_passthrough_mon_0/S00_AXI]
connect_bd_intf_net [get_bd_intf_pins v_tc_0/vtiming_out] [get_bd_intf_pins v_axi4s_vid_out_0/vtiming_in]
connect_bd_intf_net [get_bd_intf_pins axis_switch_0/M00_AXIS] [get_bd_intf_pins v_axi4s_vid_out_0/video_in]
connect_bd_intf_net [get_bd_intf_pins v_vid_in_axi4s_0/video_out] [get_bd_intf_pins axis_passthrough_mon_0/s_axis]
connect_bd_intf_net [get_bd_intf_pins ctrl] [get_bd_intf_pins v_tc_0/ctrl]
connect_bd_intf_net [get_bd_intf_pins v_axi4s_vid_out_0/vid_io_out] [get_bd_intf_pins v_vid_in_axi4s_0/vid_io_in]
connect_bd_net -net zynq_ultra_ps_e_0_pl_clk0 [get_bd_pins aclk] \
  [get_bd_pins axis_passthrough_mon_0/aclk] [get_bd_pins axis_passthrough_mon_0/s00_axi_aclk] [get_bd_pins v_tpg_0/ap_clk] \
  [get_bd_pins axis_switch_0/aclk] [get_bd_pins v_tpg_1/ap_clk] [get_bd_pins axis_switch_0/s_axi_ctrl_aclk] \
  [get_bd_pins v_tc_0/s_axi_aclk] [get_bd_pins v_vid_in_axi4s_0/aclk] [get_bd_pins v_axi4s_vid_out_0/aclk]
connect_bd_net [get_bd_pins rst_video_clk_wiz/peripheral_aresetn] [get_bd_pins v_tc_0/resetn]
connect_bd_net [get_bd_pins xlconstant_0/dout] \
  [get_bd_pins v_tc_0/clken] [get_bd_pins v_tc_0/s_axi_aclken] [get_bd_pins rst_video_clk_wiz/ext_reset_in] \
  [get_bd_pins v_axi4s_vid_out_0/aclken] [get_bd_pins v_vid_in_axi4s_0/aclken] [get_bd_pins v_vid_in_axi4s_0/axis_enable] \
  [get_bd_pins v_vid_in_axi4s_0/vid_io_in_ce]
connect_bd_net [get_bd_pins vid_io_out_clk] \
  [get_bd_pins v_tc_0/clk] [get_bd_pins v_axi4s_vid_out_0/vid_io_out_clk] [get_bd_pins rst_video_clk_wiz/slowest_sync_clk] \
  [get_bd_pins v_vid_in_axi4s_0/vid_io_in_clk]
connect_bd_net [get_bd_pins v_axi4s_vid_out_0/vtg_ce] [get_bd_pins v_tc_0/gen_clken]
connect_bd_net [get_bd_pins aresetn] \
  [get_bd_pins axis_passthrough_mon_0/aresetn] [get_bd_pins axis_passthrough_mon_0/s00_axi_aresetn] \
  [get_bd_pins v_tpg_0/ap_rst_n] [get_bd_pins axis_switch_0/aresetn] [get_bd_pins v_tpg_1/ap_rst_n] \
  [get_bd_pins axis_switch_0/s_axi_ctrl_aresetn] [get_bd_pins v_tc_0/s_axi_aresetn] [get_bd_pins v_axi4s_vid_out_0/aresetn] \
  [get_bd_pins v_vid_in_axi4s_0/aresetn]
connect_bd_net [get_bd_pins dcm_locked] [get_bd_pins rst_video_clk_wiz/dcm_locked]

current_bd_instance /
connect_bd_intf_net [get_bd_intf_pins processer_ss/M15_AXI] [get_bd_intf_pins vdma_ss/S00_AXI]
connect_bd_intf_net [get_bd_intf_pins ch_1/M00_AXIS] [get_bd_intf_pins vdma_ss/video_s1_in]
connect_bd_intf_net [get_bd_intf_pins ch_0/s_axi_CTRL] [get_bd_intf_pins processer_ss/M02_AXI]
connect_bd_intf_net [get_bd_intf_ports gpio] [get_bd_intf_pins processer_ss/gpio]
connect_bd_intf_net [get_bd_intf_pins processer_ss/S_AXI_HP0_FPD] [get_bd_intf_pins vdma_ss/M00_AXI]
connect_bd_intf_net [get_bd_intf_pins processer_ss/M14_AXI] [get_bd_intf_pins vid_out_ss/ctrl]
connect_bd_intf_net [get_bd_intf_ports uart_0] [get_bd_intf_pins processer_ss/uart_0]
connect_bd_intf_net [get_bd_intf_pins processer_ss/M10_AXI] [get_bd_intf_pins vdma_ss/S_AXI_LITE_0]
connect_bd_intf_net [get_bd_intf_ports sil9136] [get_bd_intf_pins processer_ss/IIC_0]
connect_bd_intf_net [get_bd_intf_pins ch_0/S00_AXI] [get_bd_intf_pins processer_ss/M00_AXI]
connect_bd_intf_net [get_bd_intf_pins processer_ss/M11_AXI] [get_bd_intf_pins vdma_ss/S_AXI_LITE_1]
connect_bd_intf_net [get_bd_intf_pins ch_0/M00_AXIS] [get_bd_intf_pins vdma_ss/video_s0_in]
connect_bd_intf_net [get_bd_intf_pins processer_ss/M13_AXI] [get_bd_intf_pins vid_out_ss/s_axi_lite]
connect_bd_intf_net [get_bd_intf_pins vdma_ss/M_AXIS_MM2S] [get_bd_intf_pins vid_out_ss/video_in]
connect_bd_intf_net [get_bd_intf_pins processer_ss/M12_AXI] [get_bd_intf_pins vdma_ss/S_AXI_LITE]
connect_bd_intf_net [get_bd_intf_pins processer_ss/M03_AXI] [get_bd_intf_pins ch_0/s_axi_CTRL2]
connect_bd_intf_net [get_bd_intf_pins processer_ss/M01_AXI] [get_bd_intf_pins ch_0/S_AXI_CTRL1]
connect_bd_intf_net [get_bd_intf_ports eeprom] [get_bd_intf_pins processer_ss/IIC_1]
connect_bd_intf_net [get_bd_intf_pins processer_ss/M04_AXI] [get_bd_intf_pins ch_1/S00_AXI]
connect_bd_intf_net [get_bd_intf_pins processer_ss/M05_AXI] [get_bd_intf_pins ch_1/S_AXI_CTRL1]
connect_bd_intf_net [get_bd_intf_pins processer_ss/M07_AXI] [get_bd_intf_pins ch_1/s_axi_CTRL]
connect_bd_intf_net [get_bd_intf_pins processer_ss/M06_AXI] [get_bd_intf_pins ch_1/ctrl]
connect_bd_intf_net [get_bd_intf_pins processer_ss/M16_AXI] [get_bd_intf_pins ch_0/ctrl]
connect_bd_intf_net [get_bd_intf_pins ch_1/s_axi_CTRL2] [get_bd_intf_pins processer_ss/M17_AXI]
connect_bd_net -net clk_wiz_0_clk_out1 [get_bd_pins vid_out_ss/vid_clk] [get_bd_ports vid_clk]
connect_bd_net -net rst_ps8_0_300M_peripheral_aresetn [get_bd_pins processer_ss/aresetn] \
  [get_bd_pins ch_0/aresetn] [get_bd_pins vdma_ss/aresetn] [get_bd_pins vid_out_ss/s_axi_aresetn] [get_bd_pins ch_1/aresetn]
connect_bd_net -net v_axi4s_vid_out_0_vid_active_video [get_bd_pins vid_out_ss/vid_de] [get_bd_ports vid_de]
connect_bd_net -net v_axi4s_vid_out_0_vid_data [get_bd_pins vid_out_ss/vid_data] [get_bd_ports vid_data]
connect_bd_net -net v_axi4s_vid_out_0_vid_hsync [get_bd_pins vid_out_ss/vid_hs] [get_bd_ports vid_hs]
connect_bd_net -net v_axi4s_vid_out_0_vid_vsync [get_bd_pins vid_out_ss/vid_vs] [get_bd_ports vid_vs]
connect_bd_net -net zynq_ultra_ps_e_0_pl_clk0 [get_bd_pins processer_ss/pl_clk0] \
  [get_bd_pins ch_0/aclk] [get_bd_pins vdma_ss/m_axi_mm2s_aclk] [get_bd_pins vid_out_ss/s_axi_aclk] [get_bd_pins ch_1/aclk]
connect_bd_net [get_bd_pins vdma_ss/s2mm_introut] [get_bd_pins processer_ss/In1]
connect_bd_net [get_bd_pins vdma_ss/s2mm_introut1] [get_bd_pins processer_ss/In2]
connect_bd_net [get_bd_pins vdma_ss/mm2s_introut] [get_bd_pins processer_ss/In3]
connect_bd_net -net clk_in1_1 [get_bd_pins processer_ss/pl_clk1] [get_bd_pins vid_out_ss/clk_in1]
connect_bd_net [get_bd_pins xlconstant_0/dout] [get_bd_ports eeprom_wp]
connect_bd_net -net vid_io_out_clk_1 [get_bd_pins vid_out_ss/clk_out2] [get_bd_pins ch_0/vid_io_out_clk]
connect_bd_net -net vid_io_out_clk_2 [get_bd_pins vid_out_ss/clk_out3] [get_bd_pins ch_1/vid_io_out_clk]
connect_bd_net -net dcm_locked_1 [get_bd_pins vid_out_ss/locked] [get_bd_pins ch_1/dcm_locked] [get_bd_pins ch_0/dcm_locked]

# ---- address map ----
assign_bd_address -offset 0x0080000000 -range 64K -target_address_space [get_bd_addr_spaces processer_ss/zynq_ultra_ps_e_0/Data] [get_bd_addr_segs ch_0/axis_passthrough_mon_0/S00_AXI/S00_AXI_reg]
assign_bd_address -offset 0x0080010000 -range 64K -target_address_space [get_bd_addr_spaces processer_ss/zynq_ultra_ps_e_0/Data] [get_bd_addr_segs ch_0/axis_switch_0/S_AXI_CTRL/Reg]
assign_bd_address -offset 0x0080020000 -range 64K -target_address_space [get_bd_addr_spaces processer_ss/zynq_ultra_ps_e_0/Data] [get_bd_addr_segs ch_0/v_tc_0/ctrl/Reg]
assign_bd_address -offset 0x0080030000 -range 64K -target_address_space [get_bd_addr_spaces processer_ss/zynq_ultra_ps_e_0/Data] [get_bd_addr_segs ch_0/v_tpg_0/s_axi_CTRL/Reg]
assign_bd_address -offset 0x0080040000 -range 64K -target_address_space [get_bd_addr_spaces processer_ss/zynq_ultra_ps_e_0/Data] [get_bd_addr_segs ch_0/v_tpg_1/s_axi_CTRL/Reg]
assign_bd_address -offset 0x0080050000 -range 64K -target_address_space [get_bd_addr_spaces processer_ss/zynq_ultra_ps_e_0/Data] [get_bd_addr_segs ch_1/axis_passthrough_mon_0/S00_AXI/S00_AXI_reg]
assign_bd_address -offset 0x0080060000 -range 64K -target_address_space [get_bd_addr_spaces processer_ss/zynq_ultra_ps_e_0/Data] [get_bd_addr_segs ch_1/axis_switch_0/S_AXI_CTRL/Reg]
assign_bd_address -offset 0x0080070000 -range 64K -target_address_space [get_bd_addr_spaces processer_ss/zynq_ultra_ps_e_0/Data] [get_bd_addr_segs ch_1/v_tc_0/ctrl/Reg]
assign_bd_address -offset 0x0080080000 -range 64K -target_address_space [get_bd_addr_spaces processer_ss/zynq_ultra_ps_e_0/Data] [get_bd_addr_segs ch_1/v_tpg_0/s_axi_CTRL/Reg]
assign_bd_address -offset 0x0080090000 -range 64K -target_address_space [get_bd_addr_spaces processer_ss/zynq_ultra_ps_e_0/Data] [get_bd_addr_segs ch_1/v_tpg_1/s_axi_CTRL/Reg]
assign_bd_address -offset 0x00800A0000 -range 64K -target_address_space [get_bd_addr_spaces processer_ss/zynq_ultra_ps_e_0/Data] [get_bd_addr_segs processer_ss/AXI_LITE_REG_0/S00_AXI/S00_AXI_reg]
assign_bd_address -offset 0x00800B0000 -range 64K -target_address_space [get_bd_addr_spaces processer_ss/zynq_ultra_ps_e_0/Data] [get_bd_addr_segs processer_ss/axi_uartlite_0/S_AXI/Reg]
assign_bd_address -offset 0x00800C0000 -range 64K -target_address_space [get_bd_addr_spaces processer_ss/zynq_ultra_ps_e_0/Data] [get_bd_addr_segs vdma_ss/axi_vdma_0/S_AXI_LITE/Reg]
assign_bd_address -offset 0x00800D0000 -range 64K -target_address_space [get_bd_addr_spaces processer_ss/zynq_ultra_ps_e_0/Data] [get_bd_addr_segs vdma_ss/axi_vdma_1/S_AXI_LITE/Reg]
assign_bd_address -offset 0x00800E0000 -range 64K -target_address_space [get_bd_addr_spaces processer_ss/zynq_ultra_ps_e_0/Data] [get_bd_addr_segs vdma_ss/axi_vdma_2/S_AXI_LITE/Reg]
assign_bd_address -offset 0x00800F0000 -range 64K -target_address_space [get_bd_addr_spaces processer_ss/zynq_ultra_ps_e_0/Data] [get_bd_addr_segs vdma_ss/axis_passthrough_mon_0/S00_AXI/S00_AXI_reg]
assign_bd_address -offset 0x0080100000 -range 64K -target_address_space [get_bd_addr_spaces processer_ss/zynq_ultra_ps_e_0/Data] [get_bd_addr_segs vid_out_ss/clk_wiz_0/s_axi_lite/Reg]
assign_bd_address -offset 0x0080110000 -range 64K -target_address_space [get_bd_addr_spaces processer_ss/zynq_ultra_ps_e_0/Data] [get_bd_addr_segs vid_out_ss/v_tc_0/ctrl/Reg]
assign_bd_address -offset 0x00000000 -range 2G -target_address_space [get_bd_addr_spaces vdma_ss/axi_vdma_0/Data_S2MM] [get_bd_addr_segs processer_ss/zynq_ultra_ps_e_0/SAXIGP2/HP0_DDR_LOW]
assign_bd_address -offset 0xC0000000 -range 512M -target_address_space [get_bd_addr_spaces vdma_ss/axi_vdma_0/Data_S2MM] [get_bd_addr_segs processer_ss/zynq_ultra_ps_e_0/SAXIGP2/HP0_QSPI]
exclude_bd_addr_seg -offset 0xFF000000 -range 16M -target_address_space [get_bd_addr_spaces vdma_ss/axi_vdma_0/Data_S2MM] [get_bd_addr_segs processer_ss/zynq_ultra_ps_e_0/SAXIGP2/HP0_LPS_OCM]
assign_bd_address -offset 0x00000000 -range 2G -target_address_space [get_bd_addr_spaces vdma_ss/axi_vdma_1/Data_S2MM] [get_bd_addr_segs processer_ss/zynq_ultra_ps_e_0/SAXIGP2/HP0_DDR_LOW]
assign_bd_address -offset 0xC0000000 -range 512M -target_address_space [get_bd_addr_spaces vdma_ss/axi_vdma_1/Data_S2MM] [get_bd_addr_segs processer_ss/zynq_ultra_ps_e_0/SAXIGP2/HP0_QSPI]
exclude_bd_addr_seg -offset 0xFF000000 -range 16M -target_address_space [get_bd_addr_spaces vdma_ss/axi_vdma_1/Data_S2MM] [get_bd_addr_segs processer_ss/zynq_ultra_ps_e_0/SAXIGP2/HP0_LPS_OCM]
assign_bd_address -offset 0x00000000 -range 2G -target_address_space [get_bd_addr_spaces vdma_ss/axi_vdma_2/Data_MM2S] [get_bd_addr_segs processer_ss/zynq_ultra_ps_e_0/SAXIGP2/HP0_DDR_LOW]
assign_bd_address -offset 0xC0000000 -range 512M -target_address_space [get_bd_addr_spaces vdma_ss/axi_vdma_2/Data_MM2S] [get_bd_addr_segs processer_ss/zynq_ultra_ps_e_0/SAXIGP2/HP0_QSPI]
exclude_bd_addr_seg -offset 0xFF000000 -range 16M -target_address_space [get_bd_addr_spaces vdma_ss/axi_vdma_2/Data_MM2S] [get_bd_addr_segs processer_ss/zynq_ultra_ps_e_0/SAXIGP2/HP0_LPS_OCM]

validate_bd_design
save_bd_design
